# EAGLE schematic tst (EAGLE 6.2)
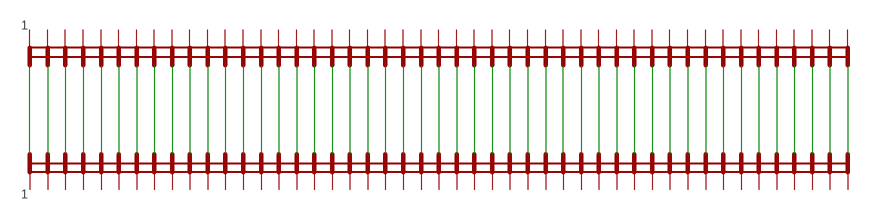
[diagram p0: schematic, sheet 1]

## Parts
U$1  47_PIN_CON  [47_PIN_CON]
U$2  47_PIN_CON  [47_PIN_CON]

## Nets
N$1: U$1.P$1 U$2.P$1
N$2: U$1.P$2 U$2.P$2
N$3: U$1.P$3 U$2.P$3
N$4: U$1.P$4 U$2.P$4
N$5: U$1.P$5 U$2.P$5
N$6: U$1.P$6 U$2.P$6
N$7: U$1.P$7 U$2.P$7
N$8: U$1.P$8 U$2.P$8
N$9: U$1.P$9 U$2.P$9
N$10: U$1.P$10 U$2.P$10
N$11: U$1.P$11 U$2.P$11
N$12: U$1.P$12 U$2.P$12
N$13: U$1.P$13 U$2.P$13
N$14: U$1.P$14 U$2.P$14
N$15: U$1.P$15 U$2.P$15
N$16: U$1.P$16 U$2.P$16
N$17: U$1.P$17 U$2.P$17
N$18: U$1.P$18 U$2.P$18
N$19: U$1.P$19 U$2.P$19
N$20: U$1.P$20 U$2.P$20
N$21: U$1.P$21 U$2.P$21
N$22: U$1.P$22 U$2.P$22
N$23: U$1.P$23 U$2.P$23
N$24: U$1.P$24 U$2.P$24
N$25: U$1.P$25 U$2.P$25
N$26: U$1.P$26 U$2.P$26
N$27: U$1.P$27 U$2.P$27
N$28: U$1.P$28 U$2.P$28
N$29: U$1.P$29 U$2.P$29
N$30: U$1.P$30 U$2.P$30
N$31: U$1.P$31 U$2.P$31
N$32: U$1.P$32 U$2.P$32
N$33: U$1.P$33 U$2.P$33
N$34: U$1.P$34 U$2.P$34
N$35: U$1.P$35 U$2.P$35
N$36: U$1.P$36 U$2.P$36
N$37: U$1.P$37 U$2.P$37
N$38: U$1.P$38 U$2.P$38
N$39: U$1.P$39 U$2.P$39
N$40: U$1.P$40 U$2.P$40
N$41: U$1.P$41 U$2.P$41
N$42: U$1.P$42 U$2.P$42
N$43: U$1.P$43 U$2.P$43
N$44: U$1.P$44 U$2.P$44
N$45: U$1.P$45 U$2.P$45
N$46: U$1.P$46 U$2.P$46
N$47: U$1.P$47 U$2.P$47

## Library data of the parts
U$1 U$2 = Dmitry:47_PIN_CON